# Altium schematic sheet Decoder.SchDoc
size A4
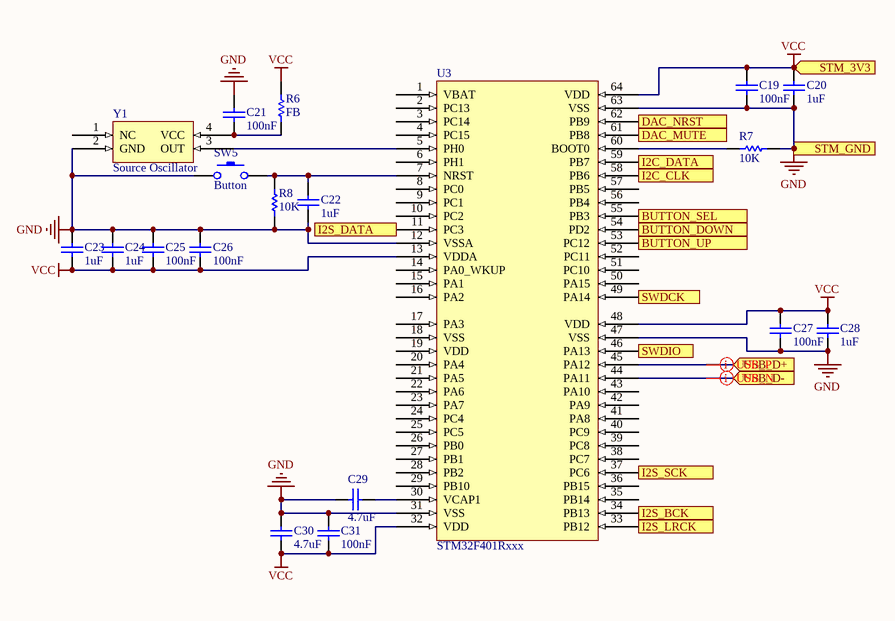
[diagram p0: Decoder.SchDoc]

## Parts
C19  100nF  [SMC_0402]
C20  1uF  [SMC_0402]
C21  100nF  [SMC_0402]
C22  1uF  [SMC_0402]
C23  1uF  [SMC_0402]
C24  1uF  [SMC_0402]
C25  100nF  [SMC_0402]
C26  100nF  [SMC_0402]
C27  100nF  [SMC_0402]
C28  1uF  [SMC_0402]
C29  4.7uF  [SMC_0402]
C30  4.7uF  [SMC_0402]
C31  100nF  [SMC_0402]
R6  FB  [SMR_0603]
R7  10K  [SMR_0402]
R8  10K  [SMR_0402]
SW5  Button  [Button]
U3  STM32F401Rxxx  [TSQFP50P1200X1200X160-64N]
Y1  Source Oscillator  [SMD_3225]

## Ports
BUTTON_DOWN (in), BUTTON_SEL (in), BUTTON_UP (in), DAC_MUTE (in), DAC_NRST (out), I2C_CLK (out), I2C_DATA (out), I2S_BCK (out), I2S_DATA (out), I2S_LRCK (out), I2S_SCK (out), STM_3V3 (in), STM_GND (out), SWDCK (in), SWDIO (in), USB_D+ (in), USB_D- (in)

## Nets
GND: C19.1 C20.1 C21.2 C22.1 C23.2 C24.2 C25.2 C26.2 C27.1 C28.1 C29.1 C30.2 C31.2 R7.2 R8.2 SW5.1 U3.12(VSSA) U3.31(VSS) U3.47(VSS) U3.63(VSS) Y1.2(GND) ; port STM_GND
VCC: C19.2 C20.2 C23.1 C24.1 C25.1 C26.1 C27.2 C28.2 C30.1 C31.1 R6.2 U3.13(VDDA) U3.32(VDD) U3.48(VDD) U3.64(VDD) ; port STM_3V3
BUTTON_DOWN: U3.54(PD2) ; port BUTTON_DOWN
BUTTON_SEL: U3.55(PB3) ; port BUTTON_SEL
BUTTON_UP: U3.53(PC12) ; port BUTTON_UP
DAC_MUTE: U3.61(PB8) ; port DAC_MUTE
DAC_NRST: U3.62(PB9) ; port DAC_NRST
I2C_CLK: U3.58(PB6) ; port I2C_CLK
I2C_DATA: U3.59(PB7) ; port I2C_DATA
I2S_BCK: U3.34(PB13) ; port I2S_BCK
I2S_DATA: U3.11(PC3) ; port I2S_DATA
I2S_LRCK: U3.33(PB12) ; port I2S_LRCK
I2S_SCK: U3.37(PC6) ; port I2S_SCK
SWDCK: U3.49(PA14) ; port SWDCK
SWDIO: U3.46(PA13) ; port SWDIO
USB_D+: U3.45(PA12) ; port USB_D+
USB_D-: U3.44(PA11) ; port USB_D-
NetC21_1: C21.1 R6.1 Y1.4(VCC)
NetC22_2: C22.2 R8.1 SW5.2 U3.7(NRST)
NetC29_2: C29.2 U3.30(VCAP1)
NetR7_1: R7.1 U3.60(BOOT0)
NetU3_5: U3.5(PH0) Y1.3(OUT)

Not connected (* = marked no-connect by the designer): U3 1(VBAT) 2(PC13) 3(PC14) 4(PC15) 6(PH1) 8(PC0) 9(PC1) 10(PC2) 14(PA0_WKUP) 15(PA1) 16(PA2) 17(PA3) 18(VSS) 19(VDD) 20(PA4) 21(PA5) 22(PA6) 23(PA7) 24(PC4) 25(PC5) 26(PB0) 27(PB1) 28(PB2) 29(PB10) 35(PB14) 36(PB15) 38(PC7) 39(PC8) 40(PC9) 41(PA8) 42(PA9) 43(PA10) 50(PA15) 51(PC10) 52(PC11) 56(PB4) 57(PB5); Y1 1(NC)

## Layout directives
differential pair: USB_D+, USB_D-

## Library data of the parts
C19-C31 = Cap Ceramic
R6-R8 = Res SMT